# EasyEDA schematic SCH_Z80-+-AY_2024-10-29.json
TITLE: Музыкальный звонок на Z80; REV: 1.0; Date: 2023-09-11; Sheet: 1/1; Drawn By: svitalys; Company: Студия 24
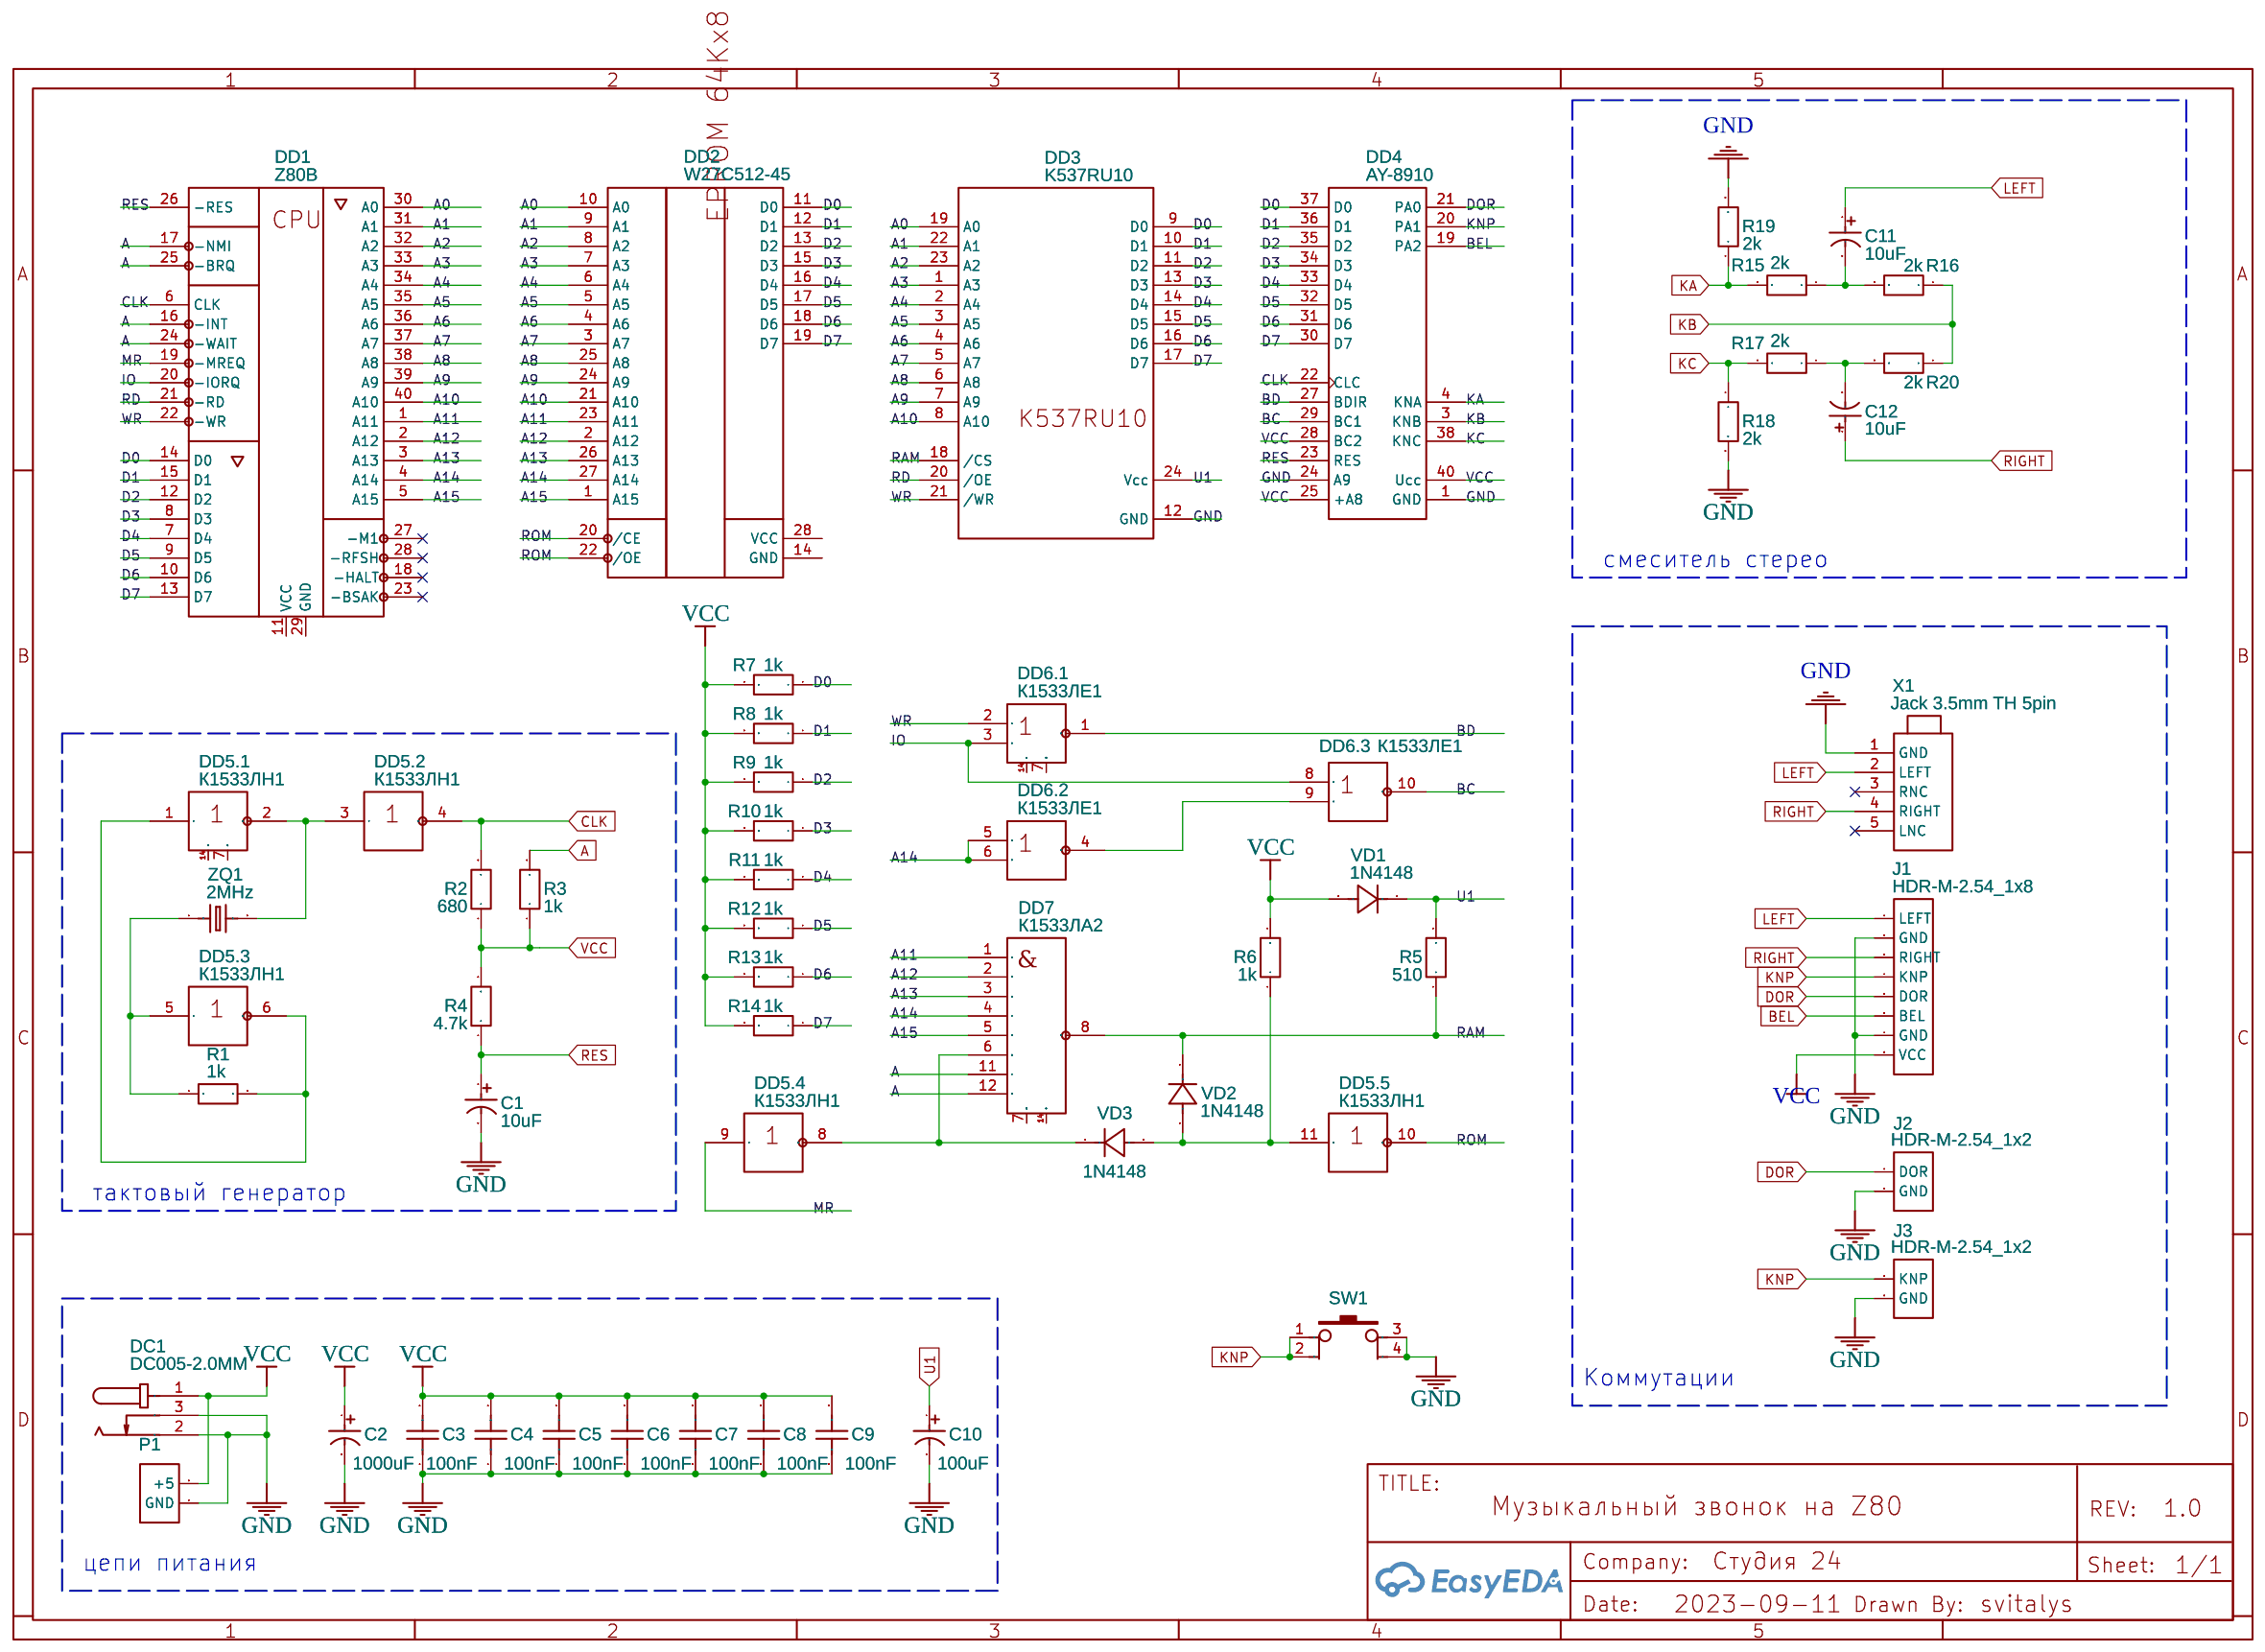
[diagram p0: schematic sheet]

## Parts
C1  10uF  [CAP-D5.0-F2.0]
C2  1000uF  [CAP-D12.5-F5.0]
C3  100nF  [CAP-TH_L5.08]
C4  100nF  [CAP-TH_L5.08]
C5  100nF  [CAP-TH_L5.08]
C6  100nF  [CAP-TH_L5.08]
C7  100nF  [CAP-TH_L5.08]
C8  100nF  [CAP-TH_L5.08]
C9  100nF  [CAP-TH_L5.08]
C10  100uF  [CAP-D6.3-F2.5]
C11  10uF  [CAP-D5.0-F2.0]
C12  10uF  [CAP-D5.0-F2.0]
DC1  DC005-2.0MM  [DC-IN-TH_DC005-T20]
DD1  Z80B  [PDIP-40_L52.3-W13.8-P2.54-LS15.24-BL]
DD2  W27C512-45  [DIP-28_L35.6-W17.8-P2.54-LS15.2-BL]
DD3  K537RU10  [DIP-24__600]
DD4  AY-8910  [DIP40]
DD5  К1533ЛН1  [DIP-14_STD]  (sections 1,2,3,4,5)
DD6  К1533ЛЕ1  [DIP-14_STD]  (sections 1,2,3)
DD7  К1533ЛА2  [DIP-14_L20.0-W7.6-P2.54-LS8.0-BL]
J1  HDR-M-2.54_1x8  [HDR-M-2.54_1X8]
J2  HDR-M-2.54_1x2  [HDR-M-2.54_1X2]
J3  HDR-M-2.54_1x2  [HDR-M-2.54_1X2]
P1  CONN-TH_2P-P5.00  [CONN-TH_2P-P5.00]
R1  1k  [RES_AXIAL-04H]
R2  680  [RES_AXIAL-04H]
R3  1k  [RES_AXIAL-04H]
R4  4.7k  [RES_AXIAL-04H]
R5  510  [RES_AXIAL-04H]
R6  1k  [RES_AXIAL-04H]
R7  1k  [RES_AXIAL-04H]
R8  1k  [RES_AXIAL-04H]
R9  1k  [RES_AXIAL-04H]
R10  1k  [RES_AXIAL-04H]
R11  1k  [RES_AXIAL-04H]
R12  1k  [RES_AXIAL-04H]
R13  1k  [RES_AXIAL-04H]
R14  1k  [RES_AXIAL-04H]
R15  2k  [RES_AXIAL-04H]
R16  2k  [RES_AXIAL-04H]
R17  2k  [RES_AXIAL-04H]
R18  2k  [RES_AXIAL-04H]
R19  2k  [RES_AXIAL-04H]
R20  2k  [RES_AXIAL-04H]
SW1  Button-SMD-4.5x4.5x5.5  [SW-SMD_4P-L4.5-W4.5-P3.00-LS7.0]
VD1  1N4148  [1N4148_1N4148W COPY]
VD2  1N4148  [1N4148_1N4148W COPY]
VD3  1N4148  [1N4148_1N4148W COPY]
X1  Jack 3.5mm TH 5pin  [JACK_TH-5P-3.5MM]
ZQ1  2MHz  [HC-49US_L11.5-W4.5-P4.88]

## Library data of the parts
C1 C11 C12 = electrolytic capacitor10UF50V: Supplier: LCSC; Manufacturer: CX(承兴); Manufacturer Part: KS106M050C07RR0VH2FP0; Supplier Part: C32856; JLCPCB Part Class: Extended Part; link: https://lcsc.com/eda_search?q=C32856&%26type=1&ref=editor
C2 C10 = electrolytic capacitor10UF50V: Supplier: LCSC; Manufacturer: CX(承兴); Manufacturer Part: KS106M050C07RR0VH2FP0; Supplier Part: C32856; JLCPCB Part Class: Extended Part; link: https://lcsc.com/eda_search?q=C32856&%26type=1&ref=editor; Package Display: No
C3-C9 = C_0805_US: Contributor: LCEDA_Lib
DC1 = DC005-2.0MM: Supplier: LCSC; Manufacturer: SOFNG(硕方); Manufacturer Part: DC005-T20; Supplier Part: C111567; JLCPCB Part Class: Extended Part; link: https://lcsc.com/eda_search?q=C111567&%26type=1&ref=editor
DD1 = Z80B: Manufacturer: Zilog; Contributor: romychs_4693
DD2 = W27C512-45: Manufacturer: Winbond; Supplier: chipdip; Contributor: Roman Boykov
DD3 = K537RU10: Contributor: slam
DD4 = AY8910: Contributor: Bud Me; Package Display: No
DD5 = К1533ЛН1: Supplier: chipdip; Contributor: Roman Boykov; subpart_no: 7
DD6 = К1533ЛЕ1: Supplier: chipdip; Contributor: Roman Boykov; subpart_no: 1
DD7 = К1533ЛА2: Supplier: chipdip; Contributor: Roman Boykov
J1 = HDR-M-2.54_1x8: Supplier Part: C190820; Supplier: LCSC; Contributor: LCEDA_Lib
J2 J3 = HDR-M-2.54_1x2: Supplier Part: C124375; Supplier: LCSC; Contributor: LCEDA_Lib
P1 = CONN-TH_2P-P5.00: Supplier: LCSC; Contributor: LCEDA_Lib
R1-R18 R20 = R0805_STD: Supplier: ChipDip; Manufacturer: Vishay; Contributor: LCSC
R19 = R0805_STD: Manufacturer: Vishay; Contributor: LCSC; Package Display: No
SW1 = Button-SMD-4.5x4.5x5.5: Supplier Part: C71849; Supplier: LCSC; Manufacturer: BBJ; Manufacturer Part: 4.5*4.5*5.5 Plastic head,260G, 0.25mm,SMD; JLCPCB Part Class: Extended Part; link: https://lcsc.com/eda_search?q=C71849&%26type=1&ref=editor
VD1-VD3 = 1N4148_C9900023663: Contributor: lcsc; Supplier: LCSC; Supplier Part: C9900023663; Manufacturer: null; JLCPCB Part Class: Extended Part; link: https://lcsc.com/eda_search?q=C9900023663&%26type=1&ref=editor
X1 = Jack 3.5mm TH 5pin: Contributor: romychs_4693
ZQ1 = HC-49S12MHZ20PF30PPM: Contributor: LCSC; Supplier: LCSC; Manufacturer: TAE(雅晶鑫); Manufacturer Part: TAXD12M2GLFBET2T; Supplier Part: C127674; JLCPCB Part Class: Extended Part; link: https://lcsc.com/eda_search?q=C127674&%26type=1&ref=editor

## Nets
GND: C1.2(-) C2.2(-) C3.1 C4.1 C5.1 C6.1 C7.1 C8.1 C9.1 C10.2(-) DC1.2 DC1.3 DD3.12(GND) DD4.1(GND) DD4.24(A9) J1.2(GND) J1.7(GND) J2.2(GND) J3.2(GND) P1.1(GND) R18.2 R19.2 SW1.3 SW1.4 X1.1(GND)
VCC: C2.1(+) C3.2 C4.2 C5.2 C6.2 C7.2 C8.2 C9.2 DC1.1 DD4.25(+A8) DD4.28(BC2) DD4.40(Ucc) J1.8(VCC) P1.2(+5) R2.1 R3.1 R4.2 R6.2 R7.2 R8.2 R9.2 R10.2 R11.2 R12.2 R13.2 R14.2 VD1.2(A)
A: DD1.16(-INT) DD1.17(-NMI) DD1.24(-WAIT) DD1.25(-BRQ) DD7.11(7) DD7.12(8) R3.2
A0: DD1.30(A0) DD2.10(A0) DD3.19(A0)
A1: DD1.31(A1) DD2.9(A1) DD3.22(A1)
A2: DD1.32(A2) DD2.8(A2) DD3.23(A2)
A3: DD1.33(A3) DD2.7(A3) DD3.1(A3)
A4: DD1.34(A4) DD2.6(A4) DD3.2(A4)
A5: DD1.35(A5) DD2.5(A5) DD3.3(A5)
A6: DD1.36(A6) DD2.4(A6) DD3.4(A6)
A7: DD1.37(A7) DD2.3(A7) DD3.5(A7)
A8: DD1.38(A8) DD2.25(A8) DD3.6(A8)
A9: DD1.39(A9) DD2.24(A9) DD3.7(A9)
A10: DD1.40(A10) DD2.21(A10) DD3.8(A10)
A11: DD1.1(A11) DD2.23(A11) DD7.1
A12: DD1.2(A12) DD2.2(A12) DD7.2
A13: DD1.3(A13) DD2.26(A13) DD7.3
A14: DD1.4(A14) DD2.27(A14) DD6.5(1) DD6.6(2) DD7.4
A15: DD1.5(A15) DD2.1(A15) DD7.5
BC: DD4.29(BC1) DD6.10(3)
BD: DD4.27(BDIR) DD6.1(3)
BEL: DD4.19(PA2) J1.6(BEL)
CLK: DD1.6(CLK) DD4.22(CLC) DD5.4(2) R2.2
D0: DD1.14(D0) DD2.11(D0) DD3.9(D0) DD4.37(D0) R7.1
D1: DD1.15(D1) DD2.12(D1) DD3.10(D1) DD4.36(D1) R8.1
D2: DD1.12(D2) DD2.13(D2) DD3.11(D2) DD4.35(D2) R9.1
D3: DD1.8(D3) DD2.15(D3) DD3.13(D3) DD4.34(D3) R10.1
D4: DD1.7(D4) DD2.16(D4) DD3.14(D4) DD4.33(D4) R11.1
D5: DD1.9(D5) DD2.17(D5) DD3.15(D5) DD4.32(D5) R12.1
D6: DD1.10(D6) DD2.18(D6) DD3.16(D6) DD4.31(D6) R13.1
D7: DD1.13(D7) DD2.19(D7) DD3.17(D7) DD4.30(D7) R14.1
DOR: DD4.21(PA0) J1.5(DOR) J2.1(DOR)
IO: DD1.20(-IORQ) DD6.3(2) DD6.8(1)
KA: DD4.4(KNA) R15.2 R19.1
KB: DD4.3(KNB) R16.1 R20.1
KC: DD4.38(KNC) R17.2 R18.1
KNP: DD4.20(PA1) J1.4(KNP) J3.1(KNP) SW1.1 SW1.2
LEFT: C11.1(+) J1.1(LEFT) X1.2(LEFT)
MR: DD1.19(-MREQ) DD5.9(1)
RAM: DD3.18(/CS) DD7.8 R5.1 VD2.1(K)
RD: DD1.21(-RD) DD3.20(/OE)
RES: C1.1(+) DD1.26(-RES) DD4.23(RES) R4.1
RIGHT: C12.1(+) J1.3(RIGHT) X1.4(RIGHT)
ROM: DD2.20(/CE) DD2.22(/OE) DD5.10(2)
U1: C10.1(+) DD3.24(Vcc) R5.2 VD1.1(K)
WR: DD1.22(-WR) DD3.21(/WR) DD6.2(1)
Net-(C11-2): C11.2(-) R15.1 R16.2
Net-(C12-2): C12.2(-) R17.1 R20.2
Net-(DD5.1-1): DD5.1 DD5.6(2) R1.2
Net-(DD5.1-2): DD5.2 DD5.3(1) ZQ1.2
Net-(DD5.3-5): DD5.5(1) R1.1 ZQ1.1
Net-(DD5.4-8): DD5.8(2) DD7.6 VD3.1(K)
Net-(DD5.5-11): DD5.11(1) R6.1 VD2.2(A) VD3.2(A)
Net-(DD6.2-4): DD6.4(3) DD6.9(2)

Not connected (* = marked no-connect by the designer): DD1 11(VCC) 18(-HALT)* 23(-BSAK)* 27(-M1)* 28(-RFSH)* 29(GND); DD2 14(GND) 28(VCC); DD5 7(GND) 14(VCC); DD6 7(GND) 14(VCC); DD7 7(GND) 14(VCC); X1 3(RNC)* 5(LNC)*

## Notes on the sheet
- смеситель стерео
- тактовый генератор
- Коммутации
- цепи питания
